# EAGLE schematic ERC_Sch (EAGLE 9.6.2)
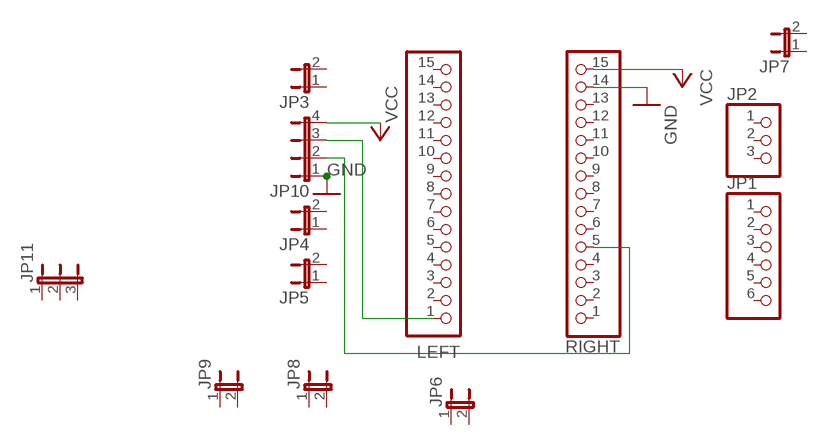
[diagram p0: schematic, sheet 1]

## Parts
JP1  PINHD-1X6  [1X06]
JP2  PINHD-1X3  [1X03]
JP3  JP1E  [JP1]
JP4  JP1E  [JP1]
JP5  JP1E  [JP1]
JP6  JP1E  [JP1]
JP7  JP1E  [JP1]
JP8  JP1E  [JP1]
JP9  JP1E  [JP1]
JP10  JP4E  [JP4]
JP11  JP2E  [JP2]
LEFT  PINHD-1X15  [1X15]
RIGHT  PINHD-1X15  [1X15]

## Nets
GND: JP10.1 JP10.3 LEFT.1 RIGHT.14
N$2: JP10.2 RIGHT.5
VCC: JP10.4 RIGHT.15
Unconnected: JP1.1 JP1.2 JP1.3 JP1.4 JP1.5 JP1.6 JP2.1 JP2.2 JP2.3 JP3.1 JP3.2 JP4.1 JP4.2 JP5.1 JP5.2 JP6.1 JP6.2 JP7.1 JP7.2 JP8.1 JP8.2 JP9.1 JP9.2 JP11.1 JP11.2 JP11.3 LEFT.2 LEFT.3 LEFT.4 LEFT.5 LEFT.6 LEFT.7 LEFT.8 LEFT.9 LEFT.10 LEFT.11 LEFT.12 LEFT.13 LEFT.14 LEFT.15 RIGHT.1 RIGHT.2 RIGHT.3 RIGHT.4 RIGHT.6 RIGHT.7 RIGHT.8 RIGHT.9 RIGHT.10 RIGHT.11 RIGHT.12 RIGHT.13

## Library data of the parts
JP1 = adafruit:PINHD-1X6: PIN HEADER
JP2 = adafruit:PINHD-1X3: PIN HEADER
JP3-JP9 = jumper:JP1E: JUMPER
JP10 = jumper:JP4E: JUMPER
JP11 = jumper:JP2E: JUMPER
LEFT RIGHT = adafruit:PINHD-1X15: PIN HEADER